# Altium schematic sheet Power.SchDoc
size A4; SheetNumber: 3; SheetTotal: 6
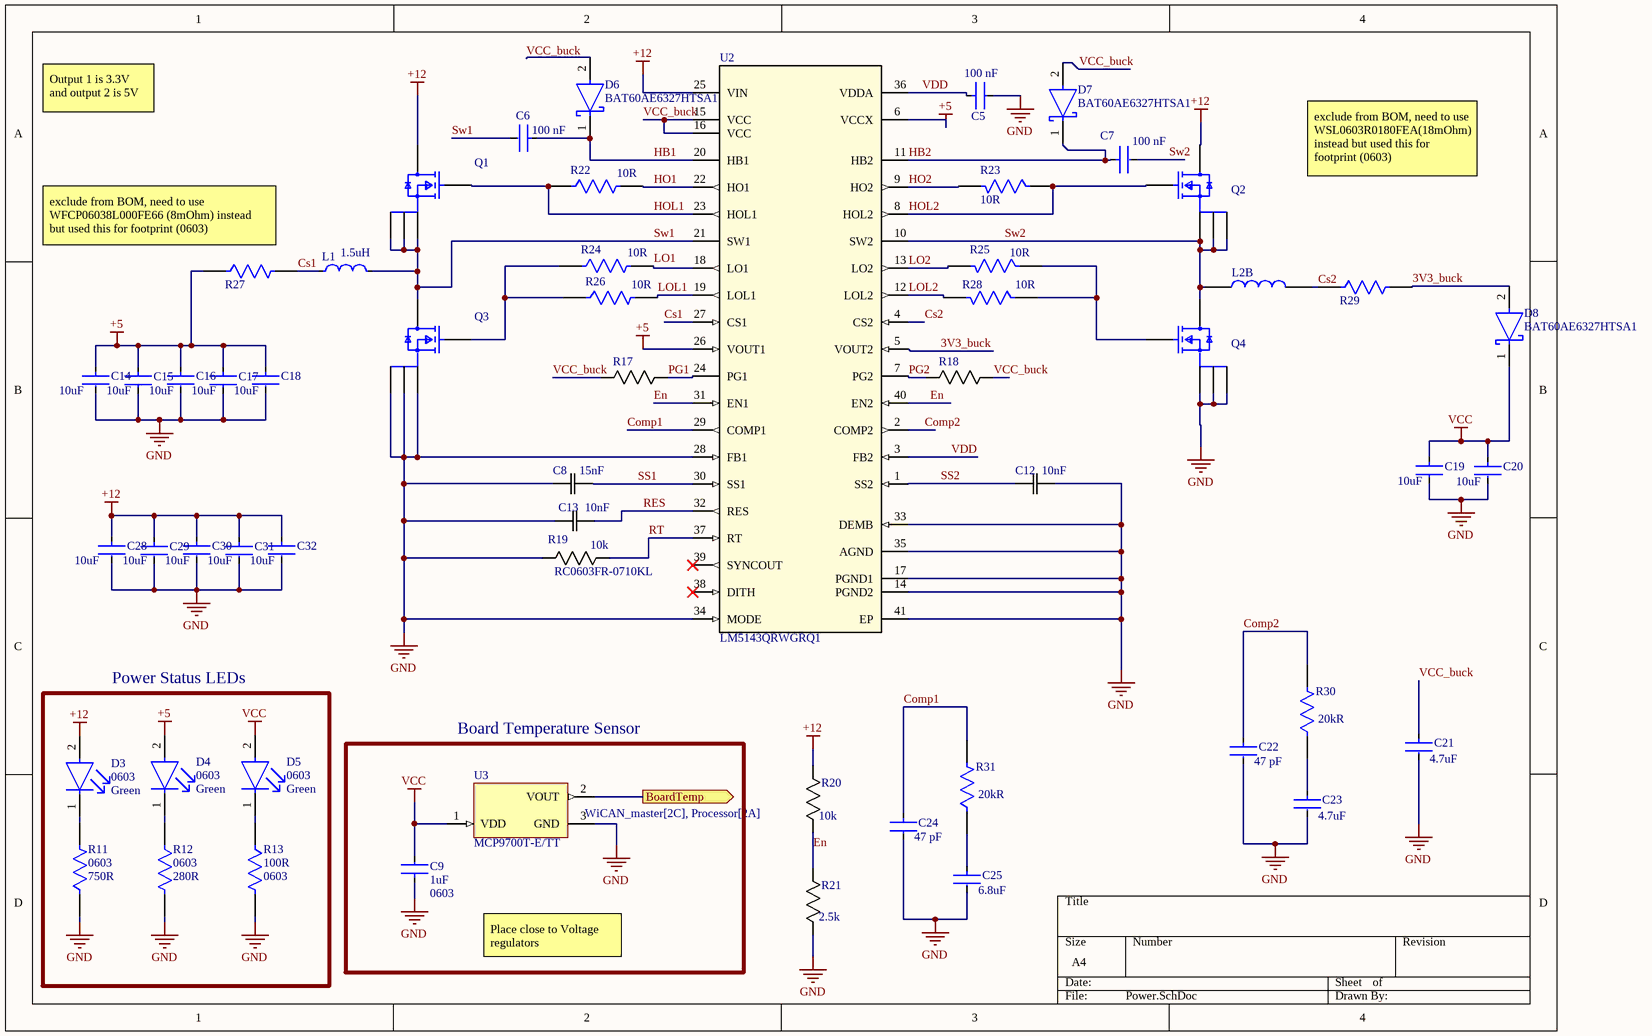
[diagram p0: Power.SchDoc]

## Parts
C5  Capacitance: 100 nF  [FP-CC0603-DA-MFG]  (hidden comment: CC0603KRX7R8BB104)
C6  Capacitance: 100 nF  [FP-CC0603-DA-MFG]  (hidden comment: CC0603KRX7R8BB104)
C7  Capacitance: 100 nF  [FP-CC0603-DA-MFG]  (hidden comment: CC0603KRX7R8BB104)
C8  Capacitance: 15nF  [CAPC17595_87N_KEM]  (hidden comment: C0603C153K5RACTU)
C9  Capacitance: 1uF  Case Code (Imperial): 0603  [FP-CL10-IPC_A]  (hidden comment: CL10A105KO8NNNC)
C12  Capacitance: 10nF  [CAPC17595_87N_KEM]  (hidden comment: C0603C153K5RACTU)
C13  Capacitance: 10nF  [CAPC17595_87N_KEM]  (hidden comment: C0603C103K5RACTU)
C14  Capacitance: 10uF  [FP-GRM188-0_15-MFG]  (hidden comment: GRM188R61A106ME69D)
C15  Capacitance: 10uF  [FP-GRM188-0_15-MFG]  (hidden comment: GRM188R61A106ME69D)
C16  Capacitance: 10uF  [FP-GRM188-0_15-MFG]  (hidden comment: GRM188R61A106ME69D)
C17  Capacitance: 10uF  [FP-GRM188-0_15-MFG]  (hidden comment: GRM188R61A106ME69D)
C18  Capacitance: 10uF  [FP-GRM188-0_15-MFG]  (hidden comment: GRM188R61A106ME69D)
C19  Capacitance: 10uF  [FP-GRM188-0_15-MFG]  (hidden comment: GRM188R61A106ME69D)
C20  Capacitance: 10uF  [FP-GRM188-0_15-MFG]  (hidden comment: GRM188R61A106ME69D)
C21  Capacitance: 4.7uF  [FP-GRM188-0_15-IPC_C]  (hidden comment: GRM188R61E475KE11D)
C22  Capacitance: 47 pF  [FP-C0603C-CF-MFG]  (hidden comment: C0603C470J5GACTU)
C23  Capacitance: 4.7uF  [FP-GRM188-0_15-IPC_C]  (hidden comment: GRM188R61E475KE11D)
C24  Capacitance: 47 pF  [FP-C0603C-CF-MFG]  (hidden comment: C0603C470J5GACTU)
C25  Capacitance: 6.8uF  [FP-C1608-080-0_1-IPC_B]  (hidden comment: C1608X5R1A685M080AC)
C28  Capacitance: 10uF  [FP-GRM188-0_15-MFG]  (hidden comment: GRM188R61A106ME69D)
C29  Capacitance: 10uF  [FP-GRM188-0_15-MFG]  (hidden comment: GRM188R61A106ME69D)
C30  Capacitance: 10uF  [FP-GRM188-0_15-MFG]  (hidden comment: GRM188R61A106ME69D)
C31  Capacitance: 10uF  [FP-GRM188-0_15-MFG]  (hidden comment: GRM188R61A106ME69D)
C32  Capacitance: 10uF  [FP-GRM188-0_15-MFG]  (hidden comment: GRM188R61A106ME69D)
D3  Case Code (Imperial): 0603  Color: Green  [FP-LTST-C190KGKT-MFG]  (hidden comment: 12V)
D4  Case Code (Imperial): 0603  Color: Green  [FP-LTST-C190KGKT-MFG]  (hidden comment: 5V)
D5  Case Code (Imperial): 0603  Color: Green  [FP-LTST-C190KGKT-MFG]  (hidden comment: 3V3)
D6  BAT60AE6327HTSA1  [FP-PG-SOD323-2-IPC_C]
D7  BAT60AE6327HTSA1  [FP-PG-SOD323-2-IPC_C]
D8  BAT60AE6327HTSA1  [FP-PG-SOD323-2-IPC_C]
L1  value 1.5uH  [FP-PCC-M0530M-LP-MFG]  (hidden comment: ETQP3M1R5KVP)
L2  CDRH104RNP-2R5NC  [CDRH104RNP-2R5NC]  (value not drawn)  (part B of 2)
Q1  CSD17579Q3A  [FP-DNH0008A-MFG]  (value not drawn)
Q2  CSD17579Q3A  [FP-DNH0008A-MFG]  (value not drawn)
Q3  CSD17579Q3A  [FP-DNH0008A-MFG]  (value not drawn)
Q4  CSD17579Q3A  [FP-DNH0008A-MFG]  (value not drawn)
R11  Case/Package: 0603  Resistance: 750R  [FP-ESR03-IPC_B]  (hidden comment: ESR03EZPJ751)
R12  Case/Package: 0603  Resistance: 280R  [FP-RMCF0603-MFG]  (hidden comment: RMCF0603FT280R)
R13  Resistance: 100R  Case/Package: 0603  [FP-AC0603-IPC_A]  (hidden comment: AC0603FR-10100RL)
R17  RC0603FR-0710KL  [RC0603N_YAG]  (value not drawn)
R18  RC0603FR-0710KL  [RC0603N_YAG]  (value not drawn)
R19  RC0603FR-0710KL  R: 10k  [RC0603N_YAG]
R20  R: 10k  [RC0603N_YAG]  (hidden comment: RC0603FR-0710KL)
R21  R: 2.5k  [RES_RNCF0603_STP]  (hidden comment: RNCF0603BTE2K50)
R22  Resistance: 10R  [FP-RMCF0603-MFG]  (hidden comment: RMCF0603FT10R0)
R23  Resistance: 10R  [FP-RMCF0603-MFG]  (hidden comment: RMCF0603FT10R0)
R24  Resistance: 10R  [FP-RMCF0603-MFG]  (hidden comment: RMCF0603FT10R0)
R25  Resistance: 10R  [FP-RMCF0603-MFG]  (hidden comment: RMCF0603FT10R0)
R26  Resistance: 10R  [FP-RMCF0603-MFG]  (hidden comment: RMCF0603FT10R0)
R27  MCT0603MD4021BP100  [FP-MCT0603-MFG]  (value not drawn)
R28  Resistance: 10R  [FP-RMCF0603-MFG]  (hidden comment: RMCF0603FT10R0)
R29  MCT0603MD4021BP100  [FP-MCT0603-MFG]  (value not drawn)
R30  Resistance: 20kR  [FP-RC0603-0_55-IPC_C]  (hidden comment: RC0603FR-0720KL)
R31  Resistance: 20kR  [FP-RC0603-0_55-IPC_C]  (hidden comment: RC0603FR-0720KL)
U2  LM5143QRWGRQ1  [RWG0040A]
U3  MCP9700T-E/TT  [SOT-23-TT3_M]

## Blocks framed on the sheet
Power Status LEDs: D3-D5 R11-R13
Board Temperature Sensor: C9 U3

## Ports
BoardTemp (out, see WiCAN_master[2C], Processor[2A])

## Nets
+5: C14.1 C15.1 C16.1 C17.1 C18.1 D4.2(A) R27.1 U2.6(VCCX) U2.26(VOUT1)
+12: C28.1 C29.1 C30.1 C31.1 C32.1 D3.2(A) Q1.5-6-7-8(D) Q2.5-6-7-8(D) R20.2 U2.25(VIN)
GND: C5.2 C8.1 C9.1 C12.2 C13.1 C14.2 C15.2 C16.2 C17.2 C18.2 C19.2 C20.2 C21.2 C22.2 C23.2 C24.2 C25.1 C28.2 C29.2 C30.2 C31.2 C32.2 Q3.1(S) Q3.2(S) Q3.3(S) Q4.1(S) Q4.2(S) Q4.3(S) R11.1 R12.2 R13.2 R19.1 R21.1 U2.14(PGND2) U2.17(PGND1) U2.28(FB1) U2.33(DEMB) U2.34(MODE) U2.35(AGND) U2.41(EP) U3.3(GND)
VCC: C9.2 C19.1 C20.1 D5.2(A) D8.1(C) U3.1(VDD)
3V3_buck: D8.2(A) R29.2 U2.5(VOUT2)
BoardTemp: U3.2(VOUT) ; port BoardTemp
Comp1: C24.1 R31.2 U2.29(COMP1)
Comp2: C22.1 R30.2 U2.2(COMP2)
Cs1: L1.1 R27.2 U2.27(CS1)
Cs2: L2.2 R29.1 U2.4(CS2)
En: R20.1 R21.2 U2.31(EN1) U2.40(EN2)
HB1: C6.1 D6.1(C) U2.20(HB1)
HB2: C7.1 D7.1(C) U2.11(HB2)
HO1: R22.2 U2.22(HO1)
HO2: R23.2 U2.9(HO2)
HOL1: Q1.4(G) R22.1 U2.23(HOL1)
HOL2: Q2.4(G) R23.1 U2.8(HOL2)
LO1: R24.2 U2.18(LO1)
LO2: R25.2 U2.13(LO2)
LOL1: R26.2 U2.19(LOL1)
LOL2: R28.2 U2.12(LOL2)
PG1: R17.2 U2.24(PG1)
PG2: R18.1 U2.7(PG2)
RES: C13.2 U2.32(RES)
RT: R19.2 U2.37(RT)
SS1: C8.2 U2.30(SS1)
SS2: C12.1 U2.1(SS2)
Sw1: C6.2 L1.2 Q1.1(S) Q1.2(S) Q1.3(S) Q3.5-6-7-8(D) U2.21(SW1)
Sw2: C7.2 L2.1 Q2.1(S) Q2.2(S) Q2.3(S) Q4.5-6-7-8(D) U2.10(SW2)
VCC_buck: C21.1 D6.2(A) D7.2(A) R17.1 R18.2 U2.15(VCC) U2.16(VCC)
VDD: C5.1 U2.3(FB2) U2.36(VDDA)
NetC23_1: C23.1 R30.1
NetC25_2: C25.2 R31.1
NetD3_1: D3.1(C) R11.2
NetD4_1: D4.1(C) R12.1
NetD5_1: D5.1(C) R13.1
NetQ3_4: Q3.4(G) R24.1 R26.1
NetQ4_4: Q4.4(G) R25.1 R28.1

Not connected (* = marked no-connect by the designer): U2 38(DITH)* 39(SYNCOUT)*

## Notes on the sheet
- Output 1 is 3.3V and output 2 is 5V
- exclude from BOM, need to use WSL0603R0180FEA(18mOhm) instead but used this for footprint (0603)
- (near R27) exclude from BOM, need to use WFCP06038L000FE66 (8mOhm) instead but used this for footprint (0603)
- Place close to Voltage regulators

## Library data of the parts
C5-C7 = CMP-03422-000234-1: CAP CER 0.1UF 25V X7R 0603; Manufacturer: YAGEO; Tolerance: 0.1; Temperature Coefficient: 15%; Material: Ceramic; Value: 100 nF; Category: Cap; ComponentLink2URL: http://www.yageo.com/documents/recent/UPY-GPHC_X7R_6.3V-to-50V_18.pdf; Voltage Rating: 25 V; ComponentLink2Description: Datasheet; RoHS: TRUE; Octopart: https://octopart.com/cc0603krx7r8bb104-yageo-8376534; Manufacturer Part Number: CC0603KRX7R8BB104; Mouser Description: CC Series 0603 0.1 uF 25 V ±10% Tolerance X7R SMT Multilayer Ceramic Capacitor; Device Class L2: Capacitors; Automotive: No; Temperature Range Low: -55°C; Lead Free: Yes; Temperature Range High: +125°C; Package: CC0603-DA; Temperature: -55°C to +125°C; Footprint Url: http://www.yageo.com/exep/pages/download/literatures/UPY-C_GEN_24.pdf; Height: 0.9mm; Voltage: 25 V; Temperature Characteristic: X7R; Device Class L3: Ceramic Capacitors; Digikey Description: CAP CER 0.1UF 25V X7R 0603; Device Class L1: Passive Components
C8 C12 = C0603C153K5RACTU: SMD Comm X7R, Ceramic, 0.015 uF, 10%, 50 VDC, X7R, SMD, MLCC, Temperature Stable, Class II, 0603; Manufacturer_Name: Kemet; Copyright: Copyright (C) 2026 Ultra Librarian. All rights reserved.; Manufacturer_Part_Number: C0603C153K5RACTU; Datasheet: https://content.kemet.com/datasheets/KEM_C1002_X7R_SMD.pdf; Digi-Key_Part_Number_1: 399-7860-2-ND; Digi-Key_Part_Number_2: 399-7860-1-ND; Digi-Key_Part_Number_3: 399-7860-6-ND
C9 = CMP-13271-001457-1: Cap Ceramic 1uF 16V X5R ±10% Pad SMD 0603 +85°C T/R; Dielectric: X5R; Height: 0.8mm; Mount: Surface Mount; Thickness: 0.035inch; Width: 0.031inch; Min Operating Temperature: -55°C; Contact Plating: Tin; Depth: 0.8mm; Length: 1.6mm; Max Operating Temperature: 85°C; Packaging: Tape and Reel; Tolerance: 10%; Radiation Hardening: No; Case/Package: 0603; Package Quantity: 1; Voltage Rating: 16V; Case Code (Metric): 1608; Voltage: 16V; Material: Ceramic; Lead Free: Lead Free; Voltage Rating (DC): 16V
C13 = C0603C103K5RACTU: SMD Comm X7R, Ceramic, 0.01 uF, 10%, 50 VDC, X7R, SMD, MLCC, Temperature Stable, Class II, 0603; Manufacturer_Name: Kemet; Copyright: Copyright (C) 2025 Ultra Librarian. All rights reserved.; Manufacturer_Part_Number: C0603C103K5RACTU
C14-C20 C28-C32 = CMP-06035-003612-1: Chip Multilayer Ceramic Capacitors for General Purpose, 0603, 10uF, X5R, 15%, 20%, 10V; Tolerance: 20%; Dielectric: X5R; Package Quantity: 4000; Width: 0.8mm; Case/Package: 0603; Thickness: 0.035inch; Voltage Rating: 10V; Voltage Rating (DC): 10V; Termination: SMD/SMT; Length: 1.6mm; Lead Free: Lead Free; Mount: Surface Mount; Height: 0.8mm; Depth: 0.8mm; Packaging: Tape and Reel; Weight: 0.000222oz; Min Operating Temperature: -55°C; Case Code (Metric): 1608; Max Operating Temperature: 85°C; Case Code (Imperial): 0603; Material: Ceramic
C21 C23 = CMP-2006-02523-2: Chip Multilayer Ceramic Capacitors for General Purpose, 0603, 4.7uF, X5R, 15%, 10%, 25V; Case Code (Metric): 1608; Max Operating Temperature: 85°C; REACH SVHC: No SVHC; Voltage Rating: 25V; Dielectric: X5R; Packaging: Cut Tape; Width: 0.031inch; Min Operating Temperature: -55°C; Lead Free: Lead Free; Height: 0.8mm; Case Code (Imperial): 0603; Length: 1.6mm; Voltage Rating (DC): 25V; Case/Package: 0603; Voltage: 25V; Tolerance: 10%; Thickness: 0.031inch; Mount: Surface Mount; Material: Ceramic; Package Quantity: 4000; Depth: 0.8mm
C22 C24 = CMP-1035-01063-3: CAP CER 47PF 50V C0G/NP0 0603; Manufacturer: KEMET; Automotive Grade: Grade 1; Material: Ceramic; Tolerance: 0.05; Temperature Coefficient: 30ppm/°C; Temperature Characteristic: C0G; Manufacturer Part Number: C0603C470J5GACTU; Package: C0603C-CF; Device Class L2: Capacitors; Height: 0.87mm; Automotive: Yes; Device Class L3: Ceramic Capacitors; RoHS: TRUE; Category: Cap; Digikey Description: CAP CER 47PF 50V C0G/NP0 0603; Octopart: https://octopart.com/c0603c470j5gactu-kemet-96565; Mouser Description: Capacitor; Ceramic; Cap; 47.0pF; Tol+5%; SMT; Vol-Rtg 50V; C0G; TR; Value: 47 pF; ComponentLink2Description: Datasheet; Voltage Rating: 50 V; Lead Free: Yes; Temperature Range Low: -55°C; ComponentLink2URL: https://api.kemet.com/component-edge/download/datasheet/C0603C100J5GACAUTO.pdf; Device Class L1: Passive Components; Temperature Range High: +125°C; Temperature: -55°C to +125°C
C25 = CMP-08246-003434-1: Multilayer Ceramic Capacitors 6.8μF ±20% 10V X5R SMD 0603; Termination: SMD/SMT; Min Operating Temperature: -55°C; Case/Package: 0603; Lead Free: Lead Free; Max Operating Temperature: 85°C; RoHS Compliant: Yes; Series: C; Dielectric Material: Ceramic; Case Code (Metric): 1608; Width: 0.031inch; Packaging: Tape and Reel; Thickness: 0.035inch; Voltage Rating (DC): 10V; Case Code (Imperial): 0603; Depth: 0.8mm; Voltage Rating: 10V; Weight: 7.1E-05oz; Mount: Surface Mount; Tolerance: 20%; Height: 0.8mm; Package Quantity: 1; Length: 1.6mm; Dielectric: X5R; Construction: Flat
D3 D5 = CMP-2000-05197-2: LED GREEN CLEAR CHIP SMD; Test Current: 20mA; Power Rating: 75mW; Forward Voltage: 2V; Wavelength: 574nm; Number of LEDs: 1; Reverse Voltage: 5V; Dominant Wavelength: 571nm; Lens Style: Diffused; Luminous Intensity: 35mcd; Forward Current: 30mA; Viewing Angle: 130°; Lens Color: Colorless; Width: 0.8mm; Case Code (Metric): 1608; Number of Pins: 2; Radiation Hardening: No; Package Quantity: 1; Lead Free: Lead Free; Lens Transparency: Clear; Depth: 0.8mm; Power Dissipation: 75mW; Mount: Surface Mount; Max Operating Temperature: 85°C; Case/Package: 0603; Height: 0.8mm; Illumination Color: Green; Length: 1.6mm; Packaging: Tape and Reel; Number of Elements: 1; Min Operating Temperature: -55°C
D4 = CMP-2000-05197-2: LED GREEN CLEAR CHIP SMD; Test Current: 20mA; Power Rating: 75mW; Forward Voltage: 2V; Wavelength: 574nm; Number of LEDs: 1; Dominant Wavelength: 571nm; Lens Style: Diffused; Luminous Intensity: 35mcd; Forward Current: 30mA; Viewing Angle: 130°; Lens Color: Colorless; Width: 0.8mm; Case Code (Metric): 1608; Number of Pins: 2; Radiation Hardening: No; Package Quantity: 1; Lead Free: Lead Free; Lens Transparency: Clear; Depth: 0.8mm; Power Dissipation: 75mW; Reverse Voltage: 5V; Mount: Surface Mount; Max Operating Temperature: 85°C; Case/Package: 0603; Height: 0.8mm; Illumination Color: Green; Length: 1.6mm; Packaging: Tape and Reel; Number of Elements: 1; Min Operating Temperature: -55°C
D6-D8 = CMP-32890-000004-1: DIODE SCHOTTKY 10V 3A SOD323-2; Forward Voltage: 370mV; Polarity: Standard; Peak Non-Repetitive Surge Current: 5A; Element Configuration: Single; Max Operating Temperature: 85°C; Current Rating: 3A; Number of Pins: 2; Mount: Surface Mount; Forward Current: 3A; Max Reverse Voltage (DC): 10V; Output Current: 3A; Contact Plating: Tin; Average Rectified Current: 3A; Lead Free: Lead Free; Max Repetitive Reverse Voltage (Vrrm): 10V; Voltage Rating (DC): 10V; Radiation Hardening: No; Halogen Free: Not Halogen Free; Case/Package: SOD-323-2; REACH SVHC: No SVHC; Min Operating Temperature: -55°C; Packaging: Tape and Reel
L1 = CMP-05439-000004-1: FIXED IND 1.5UH 8.1A 13.2 MOHM; Manufacturer: Panasonic; Rms Current: 6.7A; Shielding: true; Series Resistance: 13.2mΩ; Core Material: Metal Composite; Saturation Current: 12A; Tolerance: 20%; Automotive Grade: Grade 0; Standoff Height: 0.05mm; Test Frequency: 100kHz; Category: Ind; Temperature Range Low: -55°C; Mouser Description: Power Choke Shielded Wirewound 1.5uH 20% 100KHz Metal 8.1A 0.0132Ohm DCR Automotive T/R; Octopart: https://octopart.com/etq-p3m1r5kvp-panasonic-74144444; ComponentLink2URL: https://industrial.panasonic.com/cdbs/www-data/pdf/AGL0000/AGL0000C63.pdf; Inductance: 1.5uH; Temperature: -55°C to +155°C; Lead Free: Yes; Device Class L3: Fixed Inductors; RoHS: TRUE; Device Class L2: Inductors; Manufacturer Part Number: ETQP3M1R5KVP; Temperature Range High: +155°C; Digikey Description: FIXED IND 1.5UH 8.1A 13.2 MOHM; Package: PCC-M0530M-LP; Device Class L1: Passive Components; ComponentLink2Description: Datasheet; Automotive: Yes; Height: 3mm
L2 = CDRH104RNP-2R5NC: FIXED IND 2.5UH 6.1A 10.5 MOHM
Q1-Q4 = CMP-04962-000055-1: MOSFET N-CH 30V 35A 8VSON; Rise Time: 5ns; Fall Time: 1ns; Max Power Dissipation: 3.2W; Turn-On Delay Time: 2ns; Rds On Max: 10.2mR; Turn-Off Delay Time: 11ns; Gate to Source Voltage (Vgs): 20V; Continuous Drain Current (ID): 20A; Element Configuration: Single; Input Capacitance: 998pF; Packaging: Tape and Reel; Lead Free: Lead Free; Min Operating Temperature: -55°C; Number of Pins: 8; Contact Plating: Copper; Mount: Surface Mount; RoHS Compliant: Yes; Drain to Source Voltage (Vdss): 30V; Max Operating Temperature: 150°C
R11 = CMP-08839-029062-1: 750Ω ±5% 0.25W 0603 Anti-Surge Chip Resistor AEC-Q200; Max Power Dissipation: 250mW; Temperature Coefficient: 200ppm/°C; Length: 0.063inch; Features: Automotive AEC-Q200; Min Operating Temperature: -55°C; Tolerance: 5%; Case Code (Imperial): 0603; Case Code (Metric): 1608; RoHS Compliant: Yes; Width: 0.032inch; Number of Terminations: 2; Resistor Type: Thick Film; Height - Seated (Max): 0.022inch; Max Operating Temperature: 155°C; Series: ESR; Package Quantity: 1; Packaging: Tape and Reel; Height: 0.022inch
R12 = CMP-26527-006784-1: 280Ω ±1% 0.1W 0603 Thick Film Chip Resistor AEC-Q200 compliant; Max Power Dissipation: 100mW; Temperature Coefficient: 100ppm/°C; RoHS Compliant: Yes; Height: 0.022inch; Resistor Type: Thick Film; Case Code (Metric): 1608; Radiation Hardening: No; Contact Plating: Tin; Series: RMCF; Features: Automotive AEC-Q200; Number of Terminations: 2; Tolerance: 1%; Packaging: Tape and Reel; Max Operating Temperature: 155°C; Min Operating Temperature: -55°C; Length: 0.061inch; Lead Free: Lead Free; Width: 0.031inch; Mount: Surface Mount; Case Code (Imperial): 0603
R13 = CMP-03412-011629-2: RES 100Ω 1.00% 0.1W 0603; Tolerance: 1%; RoHS Compliant: Yes
R17 R18 = RC0603FR-0710KL: RES SMD 10kO 1% 1/10W 0603; Manufacturer_Name: Yageo; R: 10k; Copyright: Copyright (C) 2025 Ultra Librarian. All rights reserved.; Manufacturer_Part_Number: RC0603FR-0710KL
R19 R20 = RC0603FR-0710KL: RES SMD 10kO 1% 1/10W 0603; Manufacturer_Name: Yageo; Copyright: Copyright (C) 2025 Ultra Librarian. All rights reserved.; Manufacturer_Part_Number: RC0603FR-0710KL
R21 = RNCF0603BTE2K50: RES SMD 2.5K OHM 0.1% 1/6W 0603; Manufacturer_Name: Stackpole International; Copyright: Copyright (C) 2025 Ultra Librarian. All rights reserved.; Manufacturer_Part_Number: RNCF0603BTE2K50
R22-R26 R28 = CMP-26527-005040-1: 10Ω ±1% 0.1W 0603 Thick Film Chip Resistor AEC-Q200 compliant; Max Power Dissipation: 100mW; Temperature Coefficient: 100ppm/°C; Radiation Hardening: No; Military Standard: Not; Resistor Type: Thick Film; Case/Package: 0603; Case Code (Metric): 1608; Power Rating: 100mW; Min Operating Temperature: -55°C; Mount: Surface Mount; Width: 0.031inch; Packaging: Tape and Reel; Tolerance: 1%; Case Code (Imperial): 0603; Number of Terminations: 2; Height: 0.022inch; Features: Automotive AEC-Q200; Construction: Rectangular; Contact Plating: Tin; RoHS Compliant: Yes; Length: 1.55mm; Max Operating Temperature: 155°C; Depth: 0.8mm; Series: RMCF
R27 R29 = CMP-02407-000603-1: RES SMD 100 OHM 1% 1/8W 0603; Resistance: 4.02kR; Voltage Rating: 75V; Tolerance: 0.1%; Power Rating: 125mW; Packaging: Tape and Reel; Width: 0.85mm; Length: 1.55mm; Composition: Thin Film; Max Operating Temperature: 155°C; Min Operating Temperature: -55°C; Case/Package: 0603; Case Code (Metric): 1608; Case Code (Imperial): 0603; Height: 0.45mm; Weight: 6.7E-05oz
R30 R31 = CMP-2000-06932-2: RES 20K OHM 1% 1/10W 0603; Voltage Rating: 50V; Temperature Coefficient: 100ppm/°C; Power Rating: 100mW; Height: 0.022inch; REACH SVHC: No SVHC; Case Code (Metric): 1608; Depth: 0.8mm; Tolerance: 1%; Min Operating Temperature: -55°C; Series: RC; RoHS Compliant: Yes; Resistor Type: Thick Film; Max Power Dissipation: 100mW; Features: Moisture Resistant; Max Operating Temperature: 155°C; Package Quantity: 1; Size Code: 0603; Packaging: Tape and Reel; Width: 0.031inch; Length: 0.063inch; Military Standard: Not; Technology: THICK FILM; Number of Terminations: 2; Termination: SMD/SMT; Construction: Rectangular; Case/Package: 0603; Number of Pins: 2; Lead Free: Lead Free; Voltage Rating (DC): 50V; Resistance Tolerance: 1%; Case Code (Imperial): 0603
U2 = LM5143QRWGRQ1: 3.5-V to 65-V low Iq, dual, 2-phase synchronous buck DC-DC controller 40-VQFNP -40 to 150; Manufacturer_Name: Texas Instruments; TYPE: TYPE; RefDes: RefDes; Copyright: Copyright (C) 2026 Ultra Librarian. All rights reserved.; Manufacturer_Part_Number: LM5143QRWGRQ1; Datasheet: https://www.ti.com/lit/gpn/lm5143-q1
U3 = CMP-0192-00220-1: Low-Power Linear Active Thermistor IC, 3-Pin SOT-23, Extended Temperature, Tape and Reel; DatasheetVersion: revE, Apr-2009; PackageVersion: revBB, Aug-2009; PackageReference: SOT-23-TT3; Code_IPC: SOT23-3; PackageDescription: 3-Lead Plastic Small Outline Transistor (TT) [SOT-23]